# Altium project hexbot_通信板.PrjPcb
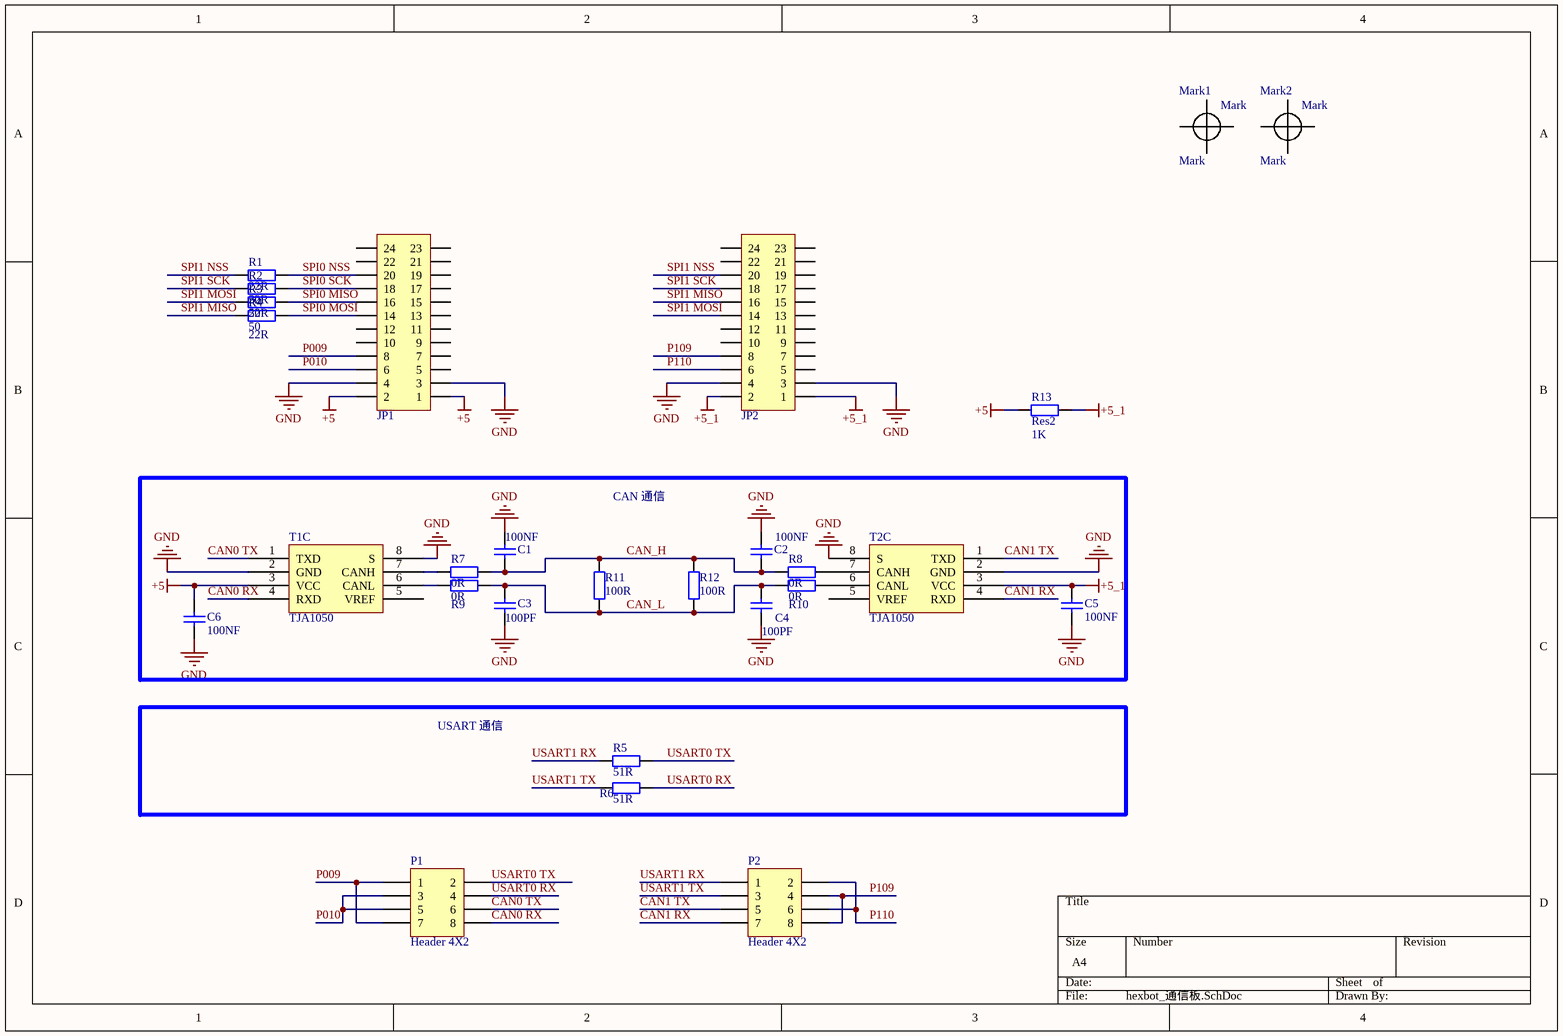
[diagram p0: hexbot_通信板.SchDoc]
1 sheet, 27 parts. Net scope: global (net labels, ports and power ports of the same name join across sheets).
Board file: hexbot_通信板.PcbDoc

## Sheet hexbot_通信板.SchDoc
size A4; SheetNumber: 1; SheetTotal: 1

### Parts
C1  100NF  [1608[0603]]
C2  100NF  [1608[0603]]
C3  100PF  [1608[0603]]
C4  100PF  [1608[0603]]
C5  100NF  [1608[0603]]
C6  100NF  [1608[0603]]
JP1  Header 2X11  [HDR2.54-WI-2x12P]  (value not drawn)
JP2  Header 2X11  [HDR2.54-WI-2x12P]  (value not drawn)
Mark1  Mark  [Mark]  (no BOM)
Mark2  Mark  [Mark]  (no BOM)
P1  Header 4X2  [HDR2X4]
P2  Header 4X2  [HDR2X4]
R1  22R  value 50  [1608[0603]]
R2  22R  value 50  [1608[0603]]
R3  22R  value 50  [1608[0603]]
R4  22R  [1608[0603]]
R5  51R  [1608[0603]]
R6  51R  [1608[0603]]
R7  0R  [1608[0603]]
R8  0R  [1608[0603]]
R9  0R  [1608[0603]]
R10  0R  [1608[0603]]
R11  100R  [1608[0603]]
R12  100R  [1608[0603]]
R13  Res2  value 1K  [1608[0603]]
T1  TJA1050  [SO8_M]  (part C of 3)
T2  TJA1050  [SO8_M]  (part C of 3)

### Blocks framed on the sheet
CAN 通信: C1-C6 R7-R12 T1 T2
USART 通信: R5 R6

### Nets
+5: C6.2 JP1.1 JP1.2 R13.1 T1.3(VCC)
+5_1: C5.2 JP2.1 JP2.2 R13.2 T2.3(VCC)
GND: C1.2 C2.2 C3.1 C4.1 C5.1 C6.1 JP1.3 JP1.4 JP2.3 JP2.4 T1.2(GND) T1.8(S) T2.2(GND) T2.8(S)
CAN0 RX: P1.8 T1.4(RXD)
CAN0 TX: P1.6 T1.1(TXD)
CAN1 RX: P2.7 T2.4(RXD)
CAN1 TX: P2.5 T2.1(TXD)
CAN_H: C1.1 C2.1 R7.2 R8.1 R11.2 R12.2
CAN_L: C3.2 C4.2 R9.2 R10.1 R11.1 R12.1
P009: JP1.8 P1.1 P1.7
P010: JP1.6 P1.3 P1.5
P109: JP2.8 P2.4 P2.8
P110: JP2.6 P2.2 P2.6
SPI0 MISO: JP1.16 R3.2
SPI0 MOSI: JP1.14 R4.2
SPI0 NSS: JP1.20 R1.2
SPI0 SCK: JP1.18 R2.2
SPI1 MISO: JP2.16 R4.1
SPI1 MOSI: JP2.14 R3.1
SPI1 NSS: JP2.20 R1.1
SPI1 SCK: JP2.18 R2.1
USART0 RX: P1.4 R6.2
USART0 TX: P1.2 R5.2
USART1 RX: P2.1 R5.1
USART1 TX: P2.3 R6.1
NetR7_1: R7.1 T1.7(CANH)
NetR8_2: R8.2 T2.7(CANH)
NetR9_1: R9.1 T1.6(CANL)
NetR10_2: R10.2 T2.6(CANL)

Not connected (* = marked no-connect by the designer): JP1 5 7 9 10 11 12 13 15 17 19 21 22 23 24; JP2 5 7 9 10 11 12 13 15 17 19 21 22 23 24; T1 5(VREF); T2 5(VREF)

### Library data of the parts
C1-C6 = Cap: Capacitor; Published: 8-Jun-2000; LatestRevisionDate: 17-Jul-2002; LatestRevisionNote: Re-released for DXP Platform.; PackageReference: RAD-0.3; Publisher: Altium Limited; PackageDescription: Radial Cap, Thru-Hole; 2 Leads; 0.3 in Pin Spacing
JP1 JP2 = Header 12X2: 12*2P接插件; 版权归属: 封装库来自淘宝卖家 ID：黄晶宝石; BOM名称: 12*2P接插件; 学习资源: https://shop463601444.taobao.com
P1 P2 = Header 4X2: Header, 4-Pin, Dual row; LatestRevisionDate: 17-Jul-2002; LatestRevisionNote: Re-released for DXP Platform.; Publisher: Altium Limited
R1-R13 = Res2: Resistor; Published: 8-Jun-2000; LatestRevisionDate: 17-Jul-2002; LatestRevisionNote: Re-released for DXP Platform.; PackageReference: AXIAL-0.4; Publisher: Altium Limited; PackageDescription: Axial Device, Thru-Hole; 2 Leads; 0.4 in Pin Spacing